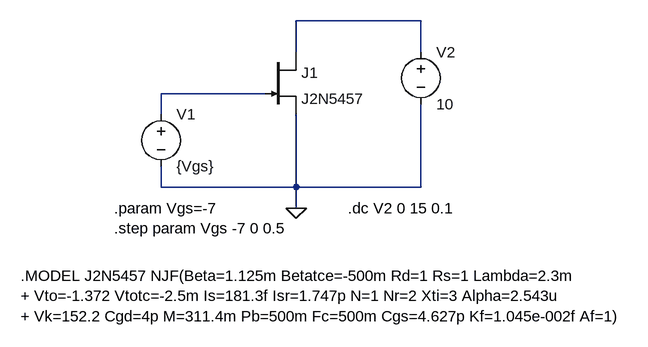
[diagram p0: schematic caract-salida.asc]
caract-salida.asc, the LTspice schematic file:
Version 4.1
SHEET 1 880 680
WIRE 432 80 240 80
WIRE 240 128 240 80
WIRE 432 128 432 80
WIRE 192 192 32 192
WIRE 32 224 32 192
WIRE 32 336 32 304
WIRE 240 336 240 224
WIRE 240 336 32 336
WIRE 432 336 432 208
WIRE 432 336 240 336
WIRE 240 368 240 336
FLAG 240 368 0
SYMBOL njf 192 128 R0
SYMATTR InstName J1
SYMATTR Value J2N5457
SYMBOL voltage 32 208 R0
WINDOW 123 0 0 Left 0
WINDOW 39 0 0 Left 0
SYMATTR InstName V1
SYMATTR Value {Vgs}
SYMBOL voltage 432 112 R0
WINDOW 123 0 0 Left 0
WINDOW 39 0 0 Left 0
SYMATTR InstName V2
SYMATTR Value 10
TEXT -184 472 Left 2 !.MODEL J2N5457 NJF(Beta=1.125m Betatce=-500m Rd=1 Rs=1 Lambda=2.3m\n+ Vto=-1.372 Vtotc=-2.5m Is=181.3f Isr=1.747p N=1 Nr=2 Xti=3 Alpha=2.543u\n+ Vk=152.2 Cgd=4p M=311.4m Pb=500m Fc=500m Cgs=4.627p Kf=1.045e-002f Af=1)
TEXT 320 368 Left 2 !.dc V2 0 15 0.1
TEXT -40 368 Left 2 !.param Vgs=-7\n.step param Vgs -7 0 0.5

The netlist it stands for:
* caract-salida.asc
J1 N001 N002 0 J2N5457
V1 N002 0 {Vgs}
V2 N001 0 10
.model NJF NJF
.model PJF PJF
.lib standard.jft
.MODEL J2N5457 NJF(Beta=1.125m Betatce=-500m Rd=1 Rs=1 Lambda=2.3m
+ Vto=-1.372 Vtotc=-2.5m Is=181.3f Isr=1.747p N=1 Nr=2 Xti=3 Alpha=2.543u
+ Vk=152.2 Cgd=4p M=311.4m Pb=500m Fc=500m Cgs=4.627p Kf=1.045e-002f Af=1)
.dc V2 0 15 0.1
.param Vgs=-7
.step param Vgs -7 0 0.5
.backanno
.end